# Altium schematic sheet Serial devises.SchDoc
size A4
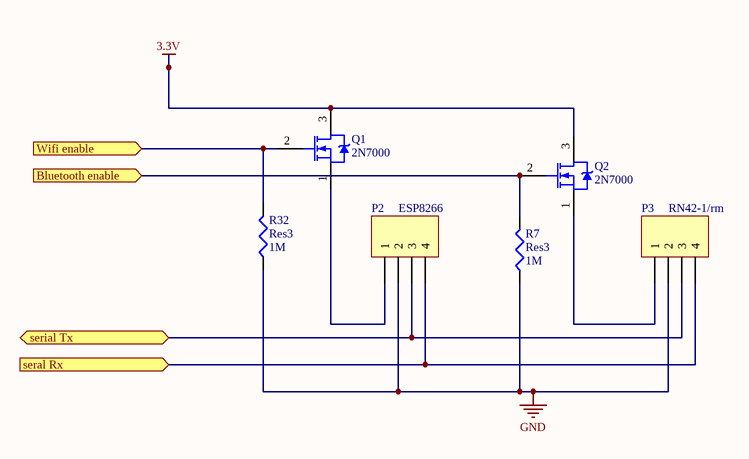
[diagram p0: Serial devises.SchDoc]

## Parts
P2  ESP8266  [HDR1X4]
P3  RN42-1/rm  [HDR1X4]
Q1  2N7000  [ONSC-SOT-323-3-419-04_V]
Q2  2N7000  [ONSC-SOT-323-3-419-04_V]
R7  Res3  value 1M  [0402]
R32  Res3  value 1M  [0402]

## Ports
Bluetooth enable (in), seral Rx (in), serial Tx (bidir), Wifi enable (in)

## Nets
3.3V: Q1.3(D) Q2.3(D)
GND: P2.2 P3.2 R7.1 R32.1
Bluetooth enable: Q2.2(G) R7.2 ; port Bluetooth enable
seral Rx: P2.4 P3.4 ; port seral Rx
serial Tx: P2.3 P3.3 ; port serial Tx
Wifi enable: Q1.2(G) R32.2 ; port Wifi enable
NetP2_1: P2.1 Q1.1(S)
NetP3_1: P3.1 Q2.1(S)

## Library data of the parts
P2 P3 = Header 4: Header, 4-Pin; LatestRevisionDate: 17-Jul-2002; LatestRevisionNote: Re-released for DXP Platform.; Publisher: Altium Limited
Q1 Q2 = 2N7000: Small Signal MOSFET, 200 mA, 60 V, N-Channel, 3-Pin TO-92, Bulk Box; Manufacturer: On Semiconductor; Channel Polarity: N Channel; Ciss Typ (pF): 60; Configuration: Single; Coss Typ (pF): 25; Crss Typ (pF): 5; ID Max (A): 0.2; PD Max (W): 0.35; VGS Max (V): 20; VGS(th) Max (V): 3; DatasheetVersion: Rev. 8; PackageVersion: Rev. AM; PackageReference: TO-92-3-29-11_AM_SL; PackageDescription: 3-Pin Transistor Outline, Body 4.825 x 3.685 mm, Pitch 1.27 mm; Package Type: TO-92; Packing: Bulk Box; V(BR)DSS Min (V): 60; Mounting Technology: Through Hole; PartNumber: 2N7000; ComponentLink1Description: Manufacturer URL; ComponentLink1URL: http://www.onsemi.com/; ComponentLink2Description: Datasheet; ComponentLink2URL: http://www.onsemi.com/pub_link/Collateral/2N7000-D.PDF; ComponentLink3Description: Package Specification; ComponentLink3URL: http://www.onsemi.cn/pub_link/Collateral/2N6426-D.PDF
R7 R32 = Res3: Resistor; Published: 8-Jun-2000; LatestRevisionDate: 29-May-2009; LatestRevisionNote: IPC-7351 Footprint Added.; PackageReference: J1-0603; Publisher: Altium Limited; PackageDescription: Chip Resistor